# EAGLE schematic Bottom Plate Schematic (EAGLE 7.4.0)
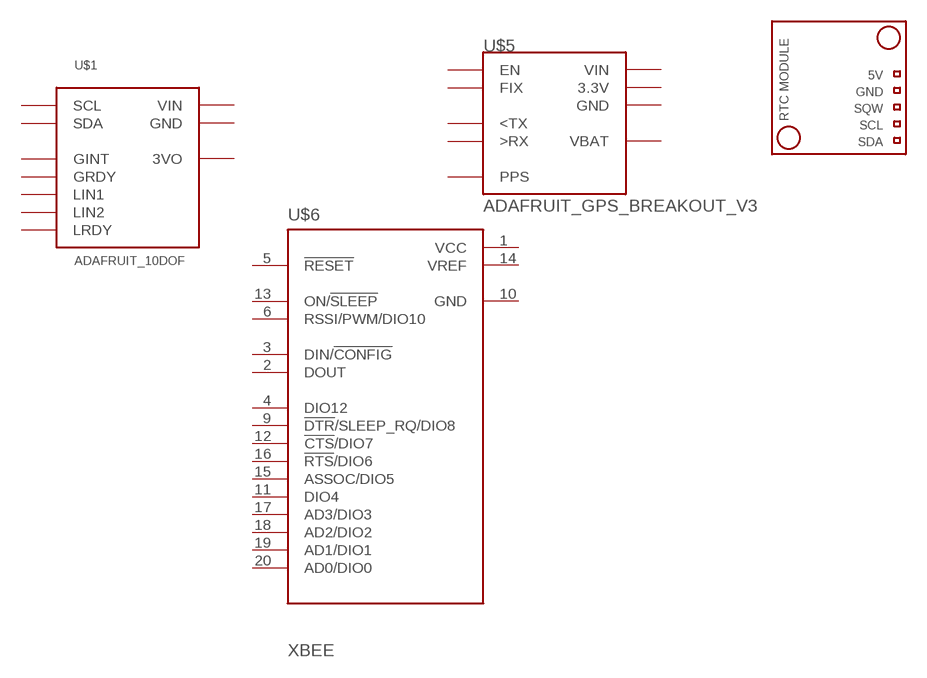
[diagram p0: schematic, sheet 1]

## Parts
U$1  ADAFRUIT_10DOF  [ADAFRUIT_10DOF]
U$5  ADAFRUIT_GPS_BREAKOUT_V3  [ADAFRUIT_GPS_BREAKOUT_V3]
U$6  XBEE  [XBEE]
U$8  REAL_TIME_CLOCK  [REAL_TIME_CLOCK]
Unconnected: U$1.GINT U$1.GRDY U$1.LIN1 U$1.LIN2 U$1.LRDY U$1.SCL U$1.SDA U$5.EN U$5.FIX U$5.PPS U$5.RX(>RX) U$5.TX(<TX) U$6.2(DOUT) U$6.3(DIN/!CONFIG) U$6.4(DIO12) U$6.5(!RESET) U$6.6(RSSI/PWM/DIO10) U$6.9(!DTR!/SLEEP_RQ/DIO8) U$6.11(DIO4) U$6.12(!CTS!/DIO7) U$6.13(ON/!SLEEP) U$6.14(VREF) U$6.15(ASSOC/DIO5) U$6.16(!RTS!/DIO6) U$6.17(AD3/DIO3) U$6.18(AD2/DIO2) U$6.19(AD1/DIO1) U$6.20(AD0/DIO0)

## Power pins joined to a net without a drawn wire
3.3V: U$5.3.3V
3VO: U$1.3VO
GND: U$1.GND U$5.GND U$6.10(GND)
VBAT: U$5.VBAT
VCC: U$6.1(VCC)
VIN: U$1.VIN U$5.VIN

## Library data of the parts
U$1 = CANSat:ADAFRUIT_10DOF
U$5 = CANSat:ADAFRUIT_GPS_BREAKOUT_V3
U$6 = CANSat:XBEE
U$8 = CANSat:REAL_TIME_CLOCK